# EAGLE design FeatherWing_for_MESH (EAGLE 9.0.0)
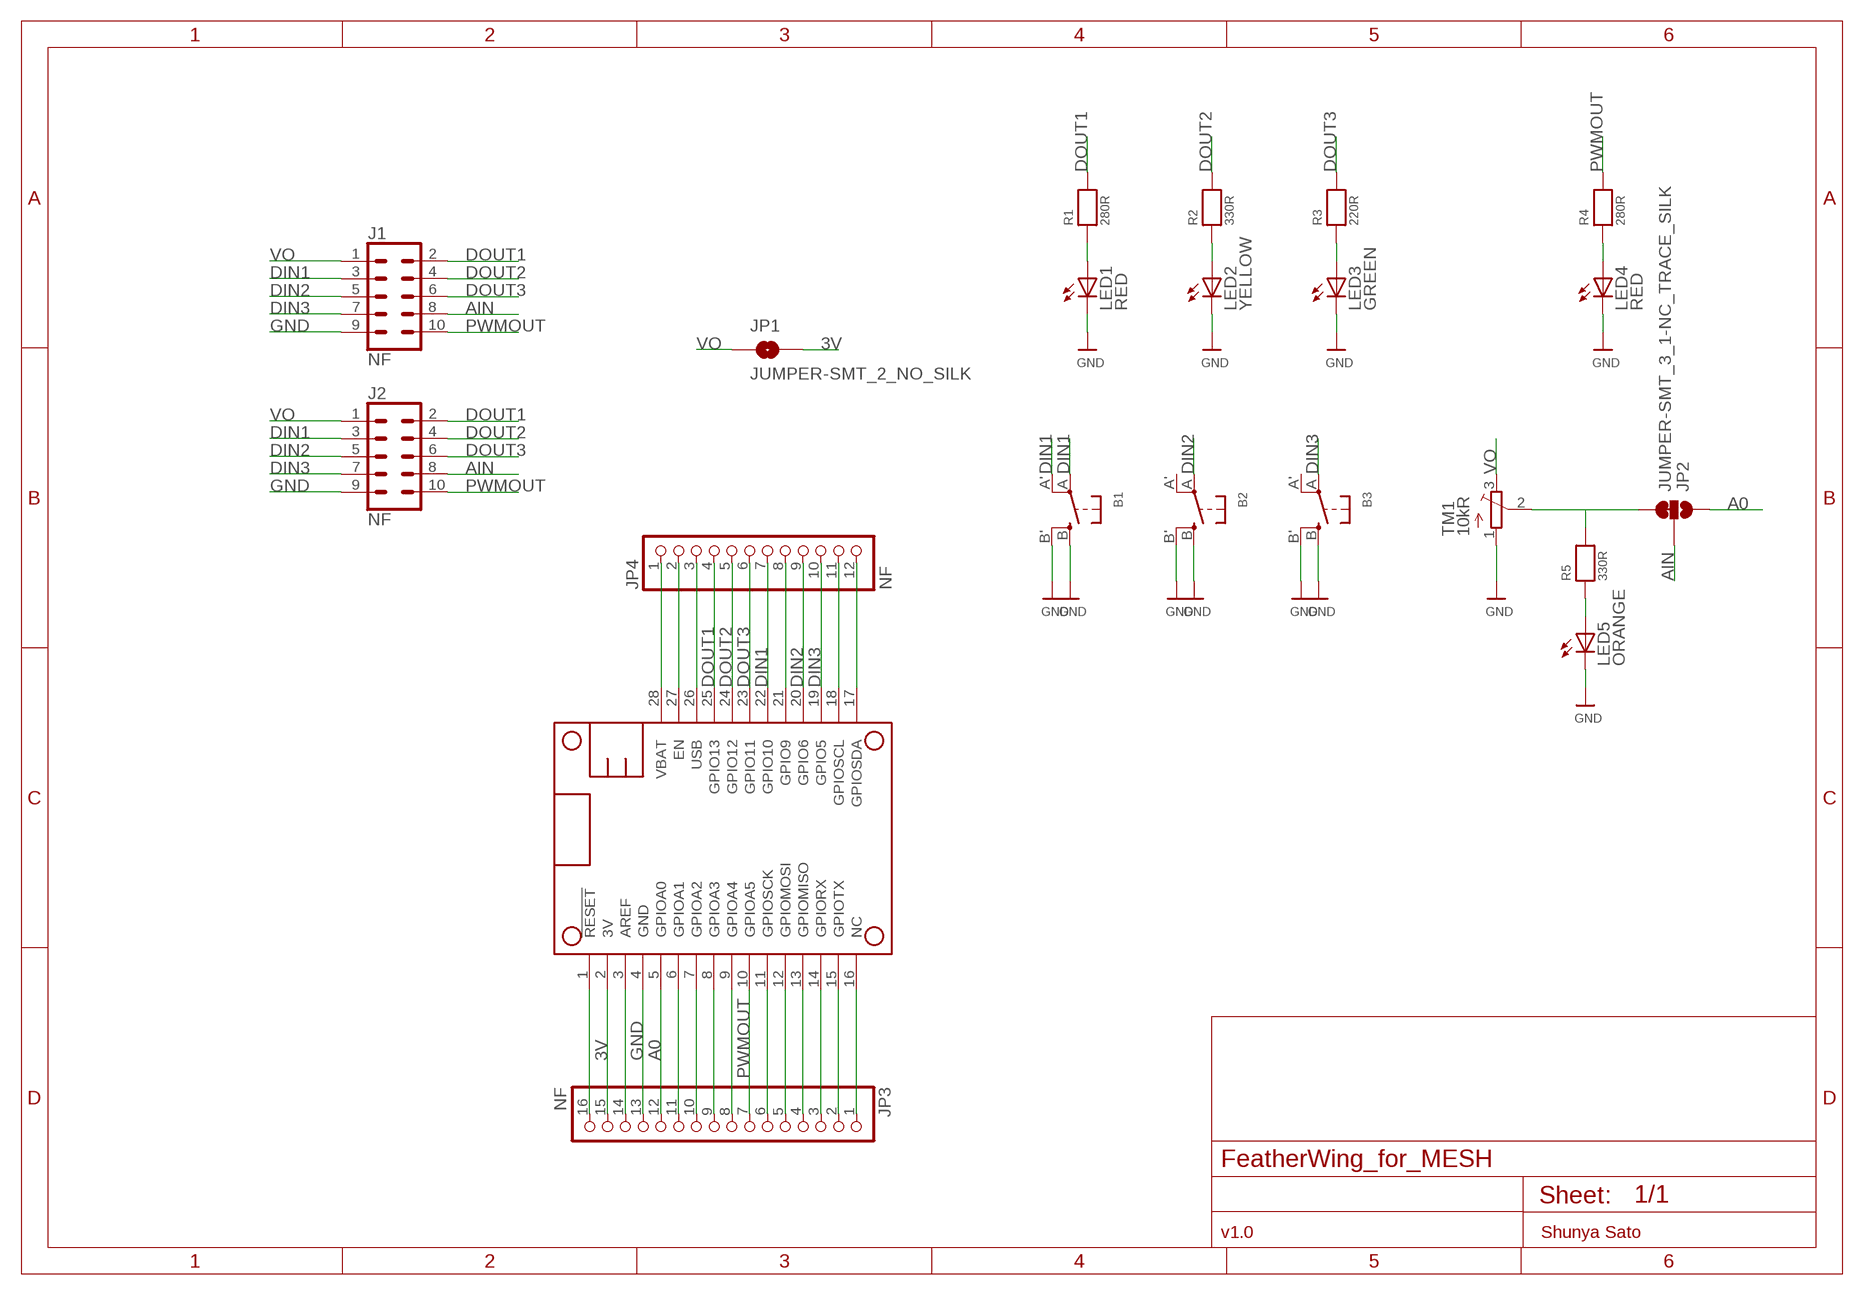
[diagram p0: schematic, sheet 1]

## Parts
B1  SWITCH_TACT_SMT4.6X2.8  [BTN_KMR2_4.6X2.8]
B2  SWITCH_TACT_SMT4.6X2.8  [BTN_KMR2_4.6X2.8]
B3  SWITCH_TACT_SMT4.6X2.8  [BTN_KMR2_4.6X2.8]
J1  NF  CONN_05X2NO_SILK  [2X5_NOSILK]
J2  NF  CONN_05X2NO_SILK  [2X5_NOSILK]
JP1  JUMPER-SMT_2_NO_SILK  [SMT-JUMPER_2_NO_SILK]
JP2  JUMPER-SMT_3_1-NC_TRACE_SILK  [SMT-JUMPER_3_1-NC_TRACE_SILK]
JP3  NF  HEADER-1X16_76MIL  [1X16_ROUND_76MIL]
JP4  NF  HEADER-1X1276MIL  [1X12_ROUND_76MIL]
LED1  RED  LEDCHIPLED_0805  [CHIPLED_0805]
LED2  YELLOW  LEDCHIPLED_0805  [CHIPLED_0805]
LED3  GREEN  LEDCHIPLED_0805  [CHIPLED_0805]
LED4  RED  LEDCHIPLED_0805  [CHIPLED_0805]
LED5  ORANGE  LEDCHIPLED_0805  [CHIPLED_0805]
MS1  FEATHERWING  [FEATHERWING]
R1  280R  RESISTOR0805_NOTHERMALS  [0805_NOTHERMALS]
R2  330R  RESISTOR0805_NOTHERMALS  [0805_NOTHERMALS]
R3  220R  RESISTOR0805_NOTHERMALS  [0805_NOTHERMALS]
R4  280R  RESISTOR0805_NOTHERMALS  [0805_NOTHERMALS]
R5  330R  RESISTOR0805_NOTHERMALS  [0805_NOTHERMALS]
TM1  10kR  TRIMPOTTC33X  [TC33X]

## Nets
3V: JP1.2 JP3.15 MS1.2(3V)
A0: JP2.1 JP3.12 MS1.5(GPIOA0)
AIN: J1.8 J2.8 JP2.2
AREF: JP3.14 MS1.3(AREF)
DIN1: B1.A'(P1) B1.A(P) J1.3 J2.3 JP4.7 MS1.22(GPIO10)
DIN2: B2.A(P) J1.5 J2.5 JP4.9 MS1.20(GPIO6)
DIN3: B3.A(P) J1.7 J2.7 JP4.10 MS1.19(GPIO5)
DOUT1: J1.2 J2.2 JP4.4 MS1.25(GPIO13) R1.2
DOUT2: J1.4 J2.4 JP4.5 MS1.24(GPIO12) R2.2
DOUT3: J1.6 J2.6 JP4.6 MS1.23(GPIO11) R3.2
GND: B1.B'(S1) B1.B(S) B2.B'(S1) B2.B(S) B3.B'(S1) B3.B(S) J1.9 J2.9 JP3.13 LED1.C LED2.C LED3.C LED4.C LED5.C MS1.4(GND) TM1.1(A)
N$1: JP4.2 MS1.27(EN)
N$2: JP3.1 MS1.16(NC)
N$4: JP3.2 MS1.15(GPIOTX)
N$6: JP3.3 MS1.14(GPIORX)
N$7: JP3.4 MS1.13(GPIOMISO)
N$8: JP3.5 MS1.12(GPIOMOSI)
N$9: JP3.6 MS1.11(GPIOSCK)
N$11: JP3.8 MS1.9(GPIOA4)
N$12: JP3.9 MS1.8(GPIOA3)
N$13: JP3.10 MS1.7(GPIOA2)
N$14: JP3.11 MS1.6(GPIOA1)
N$16: LED1.A R1.1
N$17: LED2.A R2.1
N$18: JP3.16 MS1.1(!RESET)
N$21: JP4.8 MS1.21(GPIO9)
N$24: JP4.11 MS1.18(GPIOSCL)
N$25: JP4.12 MS1.17(GPIOSDA)
N$26: LED3.A R3.1
N$27: LED4.A R4.1
N$28: JP2.3 R5.2 TM1.2(S)
N$29: LED5.A R5.1
PWMOUT: J1.10 J2.10 JP3.7 MS1.10(GPIOA5) R4.2
USB: JP4.3 MS1.26(USB)
VBAT: JP4.1 MS1.28(VBAT)
VO: J1.1 J2.1 JP1.1 TM1.3(E)
Unconnected: B2.A'(P1) B3.A'(P1)

## Notes on the sheet
- v1.0 | Shunya Sato

## Library data of the parts
B1-B3 = microbuilder:SWITCH_TACT_SMT: SMT Tact Switches 6x6mm - Digikey: P12940SCT-ND KMR2 (4.6x2.8mm) - Digikey: 401-1426-1-ND EVQ-PQHB55 - Light Touch, 160GF (4.5x4.5mm) - Digikey: P8090SCT-ND
J1 J2 = SparkFun-Connectors:CONN_05X2: Multi connection point. Often used as Generic Header-pin footprint for 0.1 inch spaced/style header connections For AVR SPI programming port, see special device with nice symbol: "AVR_SPI_PROG_5x2.dev" You can populate with any combo of single row headers, but if you'd like an exact match, check these: 2x5 AVR ICSP Male Header <https://www.sparkfun.com/products/778> (PRT-00778) 2x5 Pin Shrouded Header <https://www.sparkfun.com/products/8506> (PRT-08506) On any of the 0.1 inch spaced packages, you can populate with these: Break Away Headers - Straight <https://www.sparkfun.com/products/116> (PRT-00116) Break Away Male Headers - Right Angle <https://www.sparkfun.com/products/553> (PRT-00553) Female Headers <https://www.sparkfun.com/products/115> (PRT-00115) Break Away Headers - Machine Pin <https://www.sparkfun.com/products/117> (PRT-00117) Break Away Female Headers - Swiss Machine Pin <https://www.sparkfun.com/products/743> (PRT-00743) Special note: the shrouded connector mates well with our 5x2 ribbon cables: 2x5 Pin IDC Ribbon Cable <https://www.sparkfun.com/products/8535> (PRT-08535)
JP1 = SparkFun-Jumpers:JUMPER-SMT_2_NO: Normally open jumper This jumper has two pads in close proximity to each other. Apply solder to close the connection. Round pads are easier to solder for beginners, but are a lot larger. SparkFun Product that uses the round pads: SparkFun EL Sequencer <https://www.sparkfun.com/products/12781>
JP2 = SparkFun-Jumpers:JUMPER-SMT_3_1-NC_TRACE: Normally closed trace jumper (1 of 2 connections) This jumper has a trace between two pads so it's normally closed (NC). The other connection is normally open (NO). Use a razor knife to open the connection. For best results follow the IPC guidelines for cutting traces: Cutout at least 0.063 mm (0.005 in). Remove all loose material to clean up the cut area. Seal the cut with an approved epoxy. Reapply solder to reclose the connection, or to close the NO connection.
JP3 = microbuilder:HEADER-1X16: PIN HEADER
JP4 = microbuilder:HEADER-1X12
LED1-LED5 = adafruit:LED: LED OSRAM: - CHIPLED LG R971, LG N971, LY N971, LG Q971, LY Q971, LO R971, LY R971 LH N974, LH R974 LS Q976, LO Q976, LY Q976 LO Q996 - Hyper CHIPLED LW Q18S LB Q993, LB Q99A, LB R99A - SideLED LS A670, LO A670, LY A670, LG A670, LP A670 LB A673, LV A673, LT A673, LW A673 LH A674 LY A675 LS A676, LA A676, LO A676, LY A676, LW A676 LS A679, LY A679, LG A679 - Hyper Micro SIDELED® LS Y876, LA Y876, LO Y876, LY Y876 LT Y87S - SmartLED LW L88C, LW L88S LB L89C, LB L89S, LG L890 LS L89K, LO L89K, LY L89K LS L896, LA L896, LO L896, LY L896 - TOPLED LS T670, LO T670, LY T670, LG T670, LP T670 LSG T670, LSP T670, LSY T670, LOP T670, LYG T670 LG T671, LOG T671, LSG T671 LB T673, LV T673, LT T673, LW T673 LH T674 LS T676, LA T676, LO T676, LY T676, LB T676, LH T676, LSB T676, LW T676 LB T67C, LV T67C, LT T67C, LS T67K, LO T67K, LY T67K, LW E67C LS E67B, LA E67B, LO E67B, LY E67B, LB E67C, LV E67C, LT E67C LW T67C LS T679, LY T679, LG T679 LS T770, LO T770, LY T770, LG T770, LP T770 LB T773, LV T773, LT T773, LW T773 LH T774 LS E675, LA E675, LY E675, LS T675 LS T776, LA T776, LO T776, LY T776, LB T776 LHGB T686 LT T68C, LB T68C - Hyper Mini TOPLED® LB M676 - Mini TOPLED Santana® LG M470 LS M47K, LO M47K, LY M47K Source: http://www.osram.convergy.de/
MS1 = microbuilder:FEATHERWING
R1-R5 = microbuilder:RESISTOR: Resistors 0402 - 0402 Surface Mount Package 22 Ohm 1% 1/16W [Digikey: 311-22.0LRTR-ND] 33 Ohm 5% 1/16W 1.0K 5% 1/16W 1.5K 5% 1/16W 2.0K 1% 1/16W 10.0K 1% 1/16W [Digikey: 311-10.0KLRTR-ND] 10.0K 5% 1/16W [Digikey: RMCF0402JT10K0TR-ND] 12.1K 1% 1/16W [Digikey: 311-22.0LRTR-ND] 100.0K 5% 1/16W 0603 - 0603 Surface Mount Package 0 Ohm 1/10 Watt 1% Resistor 15 Ohm 1/10 Watt 1% Resistor 33 Ohm 1/10 Watt 1% Resistor 49.9 Ohm 1/10 Watt 1% Resistor 100 Ohm 1/10 Watt 1% Resistor 150 Ohm 1/10 Watt 1% Resistor 240 Ohm 1/10 Watt 1% Resistor 390 Ohm 1/10 Watt 1% Resistor 560 Ohm 1/10 Watt 1% Resistor 680 Ohm 1/10 Watt 1% Resistor 750 Ohm 1/10 Watt 1% Resistor 1.0K Ohm 1/10 Watt 1% Resistor 1.5K Ohm 1/10 Watt 1% Resistor 2.0K Ohm 1/10 Watt 1% Resistor 2.2K Ohm 1/10 Watt 1% Resistor 3.3K Ohm 1/10 Watt 1% Resistor 4.7K Ohm 1/10 Watt 1% Resistor 10.0K Ohm 1/10 Watt 1% Resistor 12.0K Ohm 1/10 Watt 1% Resistor 12.1K Ohm 1/10 Watt 1% Resistor 20.0K Ohm 1/10 Watt 1% Resistor 33.0K Ohm 1/10 Watt 1% Resistor 100.0K Ohm 1/10 Watt 1% Resistor 0805 - 0805 Surface Mount Package 0 Ohm 1/8 Watt 1% Resistor 33 Ohm 1/8 Watt 1% Resistor 100 Ohm 1/8 Watt 1% Resistor 150 Ohm 1/8 Watt 1% Resistor 200 Ohm 1/8 Watt 1% Resistor 240 Ohm 1/8 Watt 1% Resistor 330 Ohm 1/8 Watt 1% Resistor 390 Ohm 1/8 Watt 1% Resistor 470 Ohm 1/8 Watt 1% Resistor 1.0K Ohm 1/8 Watt 1% Resistor 1.5K Ohm 1/8 Watt 1% Resistor 2.0K Ohm 1/8 Watt 1% Resistor 4.7K Ohm 1/8 Watt 1% Resistor 5.1K Ohm 1/8 Watt 1% Resistor 5.6K Ohm 1/8 Watt 1% Resistor 10.0K Ohm 1/8 Watt 1% Resistor 22.0K Ohm 1/8 Watt 1% Resistor 33.0K Ohm 1/8 Watt 1% Resistor 100K Ohm 1/8 Watt 1% Resistor 1206 - 1206 Surface Mount Package 2012 - 2010 Surface Mount Package 0.11 Ohm 1/2 Watt 1% Resistor - Digikey: RHM.11UCT-ND
TM1 = adafruit:TRIMPOT: SMT trimmer potentiometer part number TC33X http://www.ladyada.net/library/eagle

## Board
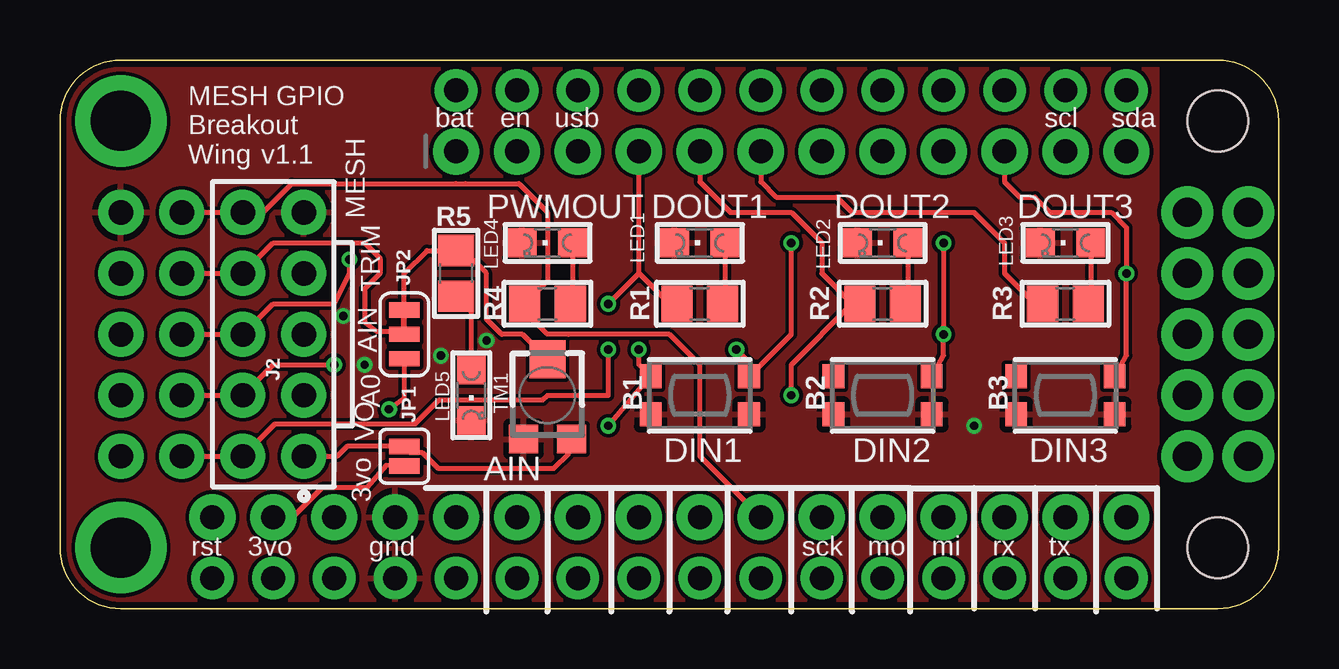
[diagram p1: board, top side]
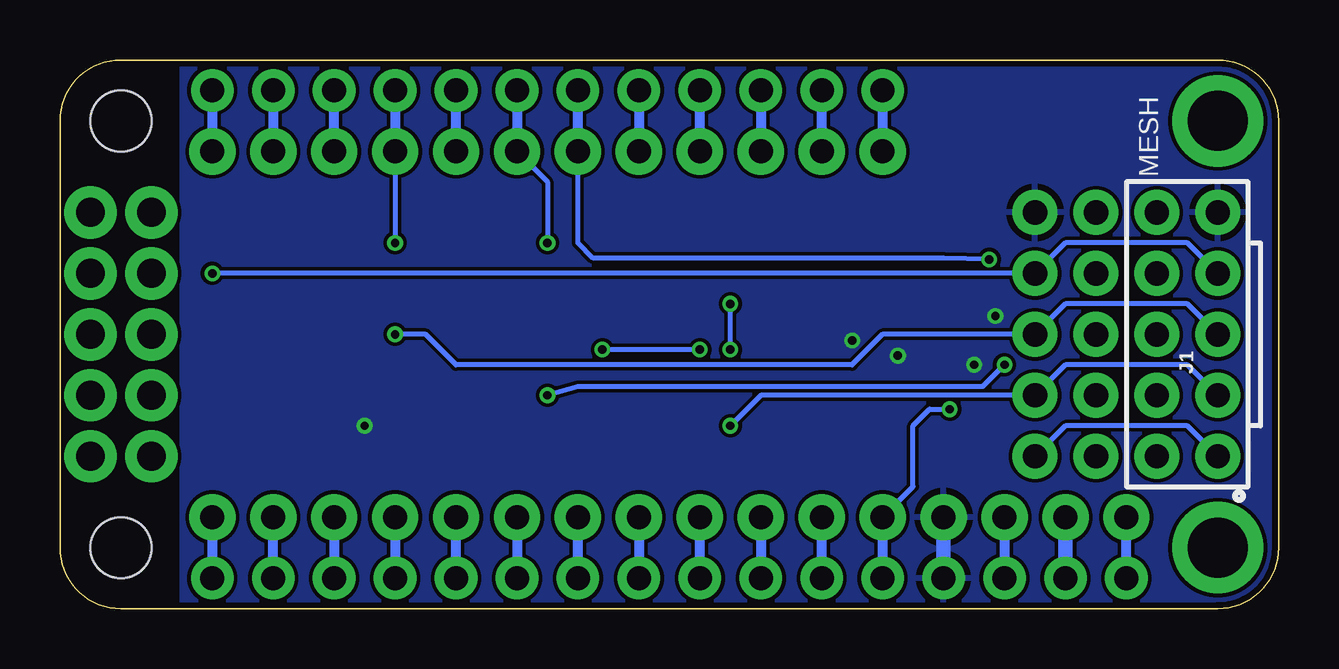
[diagram p2: board, bottom side, seen from below]

Size 50.8 x 22.86 mm. Coordinates in mm from the lower left corner, seen from the top.
Outline: 2.54,22.86 48.26,22.86 arc-90 50.8,20.32 50.8,2.54 arc-90 48.26,0 2.54,0 arc-90 0,2.54 0,20.32 arc-90 2.54,22.86
Copper layers (1*16): Top 0.035mm / dielectric 1.5mm / Bottom 0.035mm
Design rules "SeeedStudio_2layer_DRU_no_angle_20140221": minimum track width 6mil, minimum drill 12mil, track to track 6mil, track to pad 6mil, pad to pad 6mil, via to via 6mil, smd to smd 0mil, copper to edge 10mil, drill to drill 10mil, minimum pad ring 10mil, minimum via ring 6mil, stop-mask expansion 2mil, vias tented up to drill 100mil, thermal gap 10mil

### Footprints (pad centres in the part's own frame; a part is rotated, then mirrored left to right if it is on the bottom)
BTN_KMR2_4.6X2.8 = smd 0.9 x 1: A 2.05,0.8; A' -2.05,0.8; B 2.05,-0.8; B' -2.05,-0.8
2X5_NOSILK = drill 1.016 pad 1.88: 1 0,0; 2 0,2.54; 3 2.54,0; 4 2.54,2.54; 5 5.08,0; 6 5.08,2.54; 7 7.62,0; 8 7.62,2.54; 9 10.16,0; 10 10.16,2.54
SMT-JUMPER_2_NO_SILK = smd 0.635 x 1.27: 1 -0.406,0; 2 0.406,0
SMT-JUMPER_3_1-NC_TRACE_SILK = smd 0.635 x 1.27: 1 -1.016,0; 2 0,0; 3 1.016,0
1X16_ROUND_76MIL = drill 1 pad 1.93: 1 -19.05,0; 2 -16.51,0; 3 -13.97,0; 4 -11.43,0; 5 -8.89,0; 6 -6.35,0; 7 -3.81,0; 8 -1.27,0; 9 1.27,0; 10 3.81,0; 11 6.35,0; 12 8.89,0; 13 11.43,0; 14 13.97,0; 15 16.51,0; 16 19.05,0
1X12_ROUND_76MIL = drill 1 pad 1.93: 1 -13.97,0; 2 -11.43,0; 3 -8.89,0; 4 -6.35,0; 5 -3.81,0; 6 -1.27,0; 7 1.27,0; 8 3.81,0; 9 6.35,0; 10 8.89,0; 11 11.43,0; 12 13.97,0
CHIPLED_0805 = smd 1.2 x 1.2: A 0,-1.05; C 0,1.05
FEATHERWING = drill 1 pad 1.778: 1 6.35,1.27; 2 8.89,1.27; 3 11.43,1.27; 4 13.97,1.27; 5 16.51,1.27; 6 19.05,1.27; 7 21.59,1.27; 8 24.13,1.27; 9 26.67,1.27; 10 29.21,1.27; 11 31.75,1.27; 12 34.29,1.27; 13 36.83,1.27; 14 39.37,1.27; 15 41.91,1.27; 16 44.45,1.27; 17 44.45,21.59; 18 41.91,21.59; 19 39.37,21.59; 20 36.83,21.59; 21 34.29,21.59; 22 31.75,21.59; 23 29.21,21.59; 24 26.67,21.59; 25 24.13,21.59; 26 21.59,21.59; 27 19.05,21.59; 28 16.51,21.59 | drill 2.5 pad 3.81: P$1 2.54,20.32; P$2 2.54,2.54 | hole 2.54: 48.26,20.32; 48.26,2.54
0805_NOTHERMALS = smd 1.3 x 1.5: 1 -0.95,0; 2 0.95,0
TC33X = smd 1.2 x 1.2: 1 -1,-1.825; 3 1,-1.825 | smd 1.5 x 1.6: 2 0,1.5

### Placement (x,y rotation side)
B1  26.67,8.89 0 top
B2  34.29,8.89 0 top
B3  41.91,8.89 0 top
J1  2.54,6.35 90 bottom
J2  10.16,6.35 90 top
JP1  14.35,6.35 270 top
JP2  14.35,11.43 90 top
JP3  25.4,3.81 180 top
JP4  30.48,19.05 0 top
LED1  26.67,15.24 90 top
LED2  34.29,15.24 90 top
LED3  41.91,15.24 90 top
LED4  20.32,15.24 90 top
LED5  17.14,8.89 180 top
MS1  0,0 0 top
R1  26.67,12.7 180 top
R2  34.29,12.7 180 top
R3  41.91,12.7 180 top
R4  20.32,12.7 180 top
R5  16.51,13.97 90 top
TM1  20.32,8.89 0 top

### Tracks (layer width: path | path; a pad name or v marks a point on that pad's centre or on a via)
3V
  Top 0.203: JP3.15 9.71,3.81 10.93,5.03 12.78,5.03 13.59,5.97 JP1.2
  Bottom 0.61: JP3.15 MS1.2
A0  (via drill 0.35)
  Top 0.203: JP2.1 14.35,8.76 v13.72,8.31
  Bottom 0.203: JP3.12 15.24,5.08 15.24,7.62 14.55,8.31 v13.72,8.31
  Bottom 0.406: JP3.12 MS1.5
AIN
  Top 0.203: J1.8 J2.8 8.89,15.24 12.7,15.24 13.34,14.61 13.34,13.97 12.7,13.34 12.7,11.94 13.21,11.56 13.84,11.56 13.97,11.43 JP2.2
AREF
  Bottom 0.406: JP3.14 MS1.3
DIN1  (via drill 0.35)
  Top 0.203: v30.48,15.24 30.48,11.43 29.21,10.16 B1.A 28.72,10.27 v28.19,10.79 | v22.86,7.62 B1.A' 24.13,10.18 v24.13,10.79
  Bottom 0.203: JP4.7 30.48,17.78 v30.48,15.24 | J1.3 3.81,10.16 8.89,10.16 J2.3 21.59,8.89 v22.86,7.62 | v24.13,10.79 v28.19,10.79
  Bottom 0.406: MS1.22 JP4.7
DIN2  (via drill 0.35)
  Top 0.203: v36.83,15.24 v36.83,11.43 36.83,10.55 B2.A
  Bottom 0.203: JP4.9 v36.83,15.24 | J1.5 3.81,12.7 8.89,12.7 J2.5 16.51,11.43 17.78,10.16 34.29,10.16 35.56,11.43 v36.83,11.43
  Bottom 0.406: MS1.20 JP4.9
DIN3  (via drill 0.35)
  Top 0.203: JP4.10 39.37,17.78 40.01,17.14 40.64,17.14 41.27,16.51 43.81,16.51 44.45,15.88 v44.45,13.97 44.45,10.55 B3.A
  Bottom 0.203: J1.7 3.81,15.24 8.89,15.24 J2.7 v44.45,13.97
  Bottom 0.406: JP4.10 MS1.19
DOUT1  (via drill 0.35)
  Top 0.203: J1.2 J2.2 8.97,7.7 14.81,7.7 15.8,8.69 20.12,8.69 20.32,8.89 22.86,8.89 v22.86,10.79 | R1.2 25.4,12.7 24.13,13.97 | 24.13,13.97 JP4.4 | v22.86,12.7 24.13,13.97
  Bottom 0.203: v22.86,10.79 v22.86,12.7
  Bottom 0.406: JP4.4 MS1.25
DOUT2  (via drill 0.35)
  Top 0.203: JP4.5 26.67,17.78 27.94,16.51 30.48,16.51 31.75,15.24 31.75,13.97 33.02,12.7 | J1.4 J2.4 8.89,10.16 v11.43,10.16 | v30.48,8.89 30.48,10.16 33.02,12.7 | 33.02,12.7 R2.2
  Bottom 0.203: v11.43,10.16 12.34,9.25 29.21,9.25 v30.48,8.89
  Bottom 0.406: MS1.24 JP4.5
DOUT3  (via drill 0.35)
  Top 0.203: JP4.6 29.21,17.78 29.84,17.14 32.38,17.14 33.02,16.51 38.1,16.51 39.37,15.24 39.37,13.97 40.64,12.7 R3.2 | J1.6 J2.6 8.89,12.7 11.43,12.7 12.06,13.97 v12.06,14.55
  Bottom 0.203: v12.06,14.55 13.97,14.61 28.57,14.61 29.21,15.24 JP4.6
  Bottom 0.406: JP4.6 MS1.23
GND  (via drill 0.35)
  Bottom 0.61: JP3.13 MS1.4
  other vias: 38.1,7.62 11.81,12.19 12.7,10.16 17.78,11.18 15.88,10.54
  pour Bottom: 0,0 0,22.86 45.72,22.86 45.72,0
  pour Top (isolate 0.152): 0,0 0,22.86 45.72,22.86 45.72,0
N$1
  Bottom 0.406: JP4.2 MS1.27
N$2
  Bottom 0.406: JP3.1 MS1.16
N$4
  Bottom 0.406: MS1.15 JP3.2
N$6
  Bottom 0.406: JP3.3 MS1.14
N$7
  Bottom 0.406: JP3.4 MS1.13
N$8
  Bottom 0.406: MS1.12 JP3.5
N$9
  Bottom 0.406: JP3.6 MS1.11
N$11
  Bottom 0.406: JP3.8 MS1.9
N$12
  Bottom 0.406: MS1.8 JP3.9
N$13
  Bottom 0.406: JP3.10 MS1.7
N$14
  Bottom 0.406: MS1.6 JP3.11
N$16
  Top 0.203: LED1.A 27.72,12.8 R1.1
N$17
  Top 0.203: LED2.A 35.34,12.8 R2.1
N$18
  Bottom 0.406: MS1.1 JP3.16
N$21
  Bottom 0.406: JP4.8 MS1.21
N$24
  Bottom 0.406: MS1.18 JP4.11
N$25
  Bottom 0.406: MS1.17 JP4.12
N$26
  Top 0.203: LED3.A 42.96,12.8 R3.1
N$27
  Top 0.203: LED4.A 21.37,12.8 R4.1
N$28
  Top 0.203: TM1.2 19.28,11.43 18.41,11.43 17.78,12.06 17.78,13.97 16.89,14.86 16.83,14.92 R5.2 15.3,14.92 14.35,13.97 JP2.3
N$29
  Top 0.203: R5.1 17.14,12.38 LED5.A
N$30  (via drill 1.2 pad 2.18)
  other vias: 46.99,8.89
N$31  (via drill 1.2 pad 2.18)
  other vias: 49.53,16.51
N$32  (via drill 1.2 pad 2.18)
  other vias: 46.99,16.51
N$33  (via drill 1.2 pad 2.18)
  other vias: 49.53,8.89
N$36  (via drill 1.2 pad 2.18)
  other vias: 46.99,13.97
N$37  (via drill 1.2 pad 2.18)
  other vias: 49.53,13.97
N$42  (via drill 1.2 pad 2.18)
  other vias: 46.99,11.43
N$43  (via drill 1.2 pad 2.18)
  other vias: 49.53,11.43
N$47  (via drill 1.2 pad 2.18)
  other vias: 49.53,6.35
N$48  (via drill 1.2 pad 2.18)
  other vias: 46.99,6.35
PWMOUT
  Top 0.203: J1.10 J2.10 8.47,16.51 9.67,17.7 16.51,17.7 16.91,17.7 19.13,17.7 20.32,16.51 20.32,13.65 R4.2 19.37,12.38 20.31,11.44 21.18,11.44 21.19,11.43 25.4,11.43 26.67,10.16 26.67,6.35 JP3.7
  Bottom 0.406: MS1.10 JP3.7
USB
  Bottom 0.406: MS1.26 JP4.3
VBAT
  Bottom 0.406: MS1.28 JP4.1
VO
  Top 0.203: J2.1 11.56,6.35 11.96,6.76 JP1.1 14.59,6.51 15.09,6.51 15.76,5.84 20.57,5.84 21.21,6.48 21.21,6.95 TM1.3
  Bottom 0.203: J1.1 3.81,7.62 8.89,7.62 J2.1

### Text on the board
tPlace: bat | en | usb | scl | sda | MESH GPIO / Breakout / Wing | v1.1 | MESH | PWMOUT | DOUT1 | DOUT2 | DOUT3 | TRIM | AIN | A0 | VO | DIN1 | DIN2 | DIN3 | AIN | 3vo | rst | 3vo | gnd | sck | mo | mi | rx | tx
bPlace: MESH